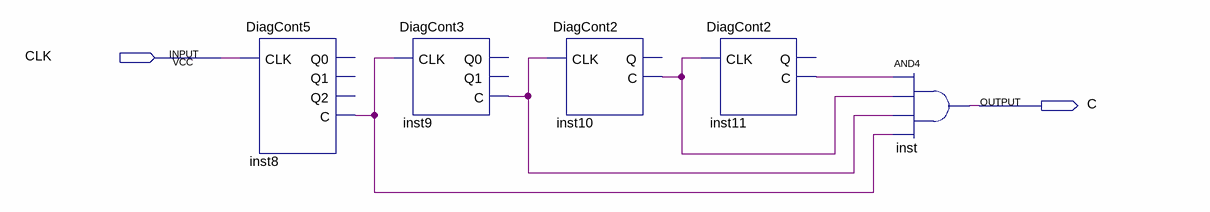
[diagram p0: schematic sheet]
// Quartus schematic DiagCont60.bdf as structural Verilog: 5 symbols, 2 pins
module DiagCont60 (
  input  CLK,
  output C
);

  wire inst8_c, inst9_c, inst10_c, inst11_c;

  DiagCont5 inst8 (.CLK(CLK), .C(inst8_c));  // open: Q0, Q1, Q2
  DiagCont3 inst9 (.CLK(inst8_c), .C(inst9_c));  // open: Q0, Q1
  DiagCont2 inst10 (.CLK(inst9_c), .C(inst10_c));  // open: Q
  DiagCont2 inst11 (.CLK(inst10_c), .C(inst11_c));  // open: Q
  and inst (C, inst11_c, inst10_c, inst9_c, inst8_c);
endmodule
